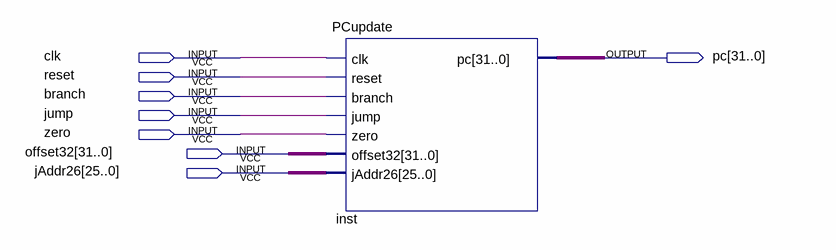
[diagram p0: schematic sheet]
// Quartus schematic PC_update.bdf as structural Verilog: 1 symbols, 8 pins
module PC_update (
  input  clk,
  input  reset,
  input  branch,
  input  jump,
  input  zero,
  input  [31:0] offset32,
  input  [25:0] jAddr26,
  output [31:0] pc
);

  PCupdate inst (
    .clk(clk), .reset(reset), .branch(branch), .jump(jump), .zero(zero), .offset32(offset32),
    .jAddr26(jAddr26), .pc(pc));
endmodule
